# EAGLE design roland_121_vcf_with_12db (EAGLE 7.2.0)
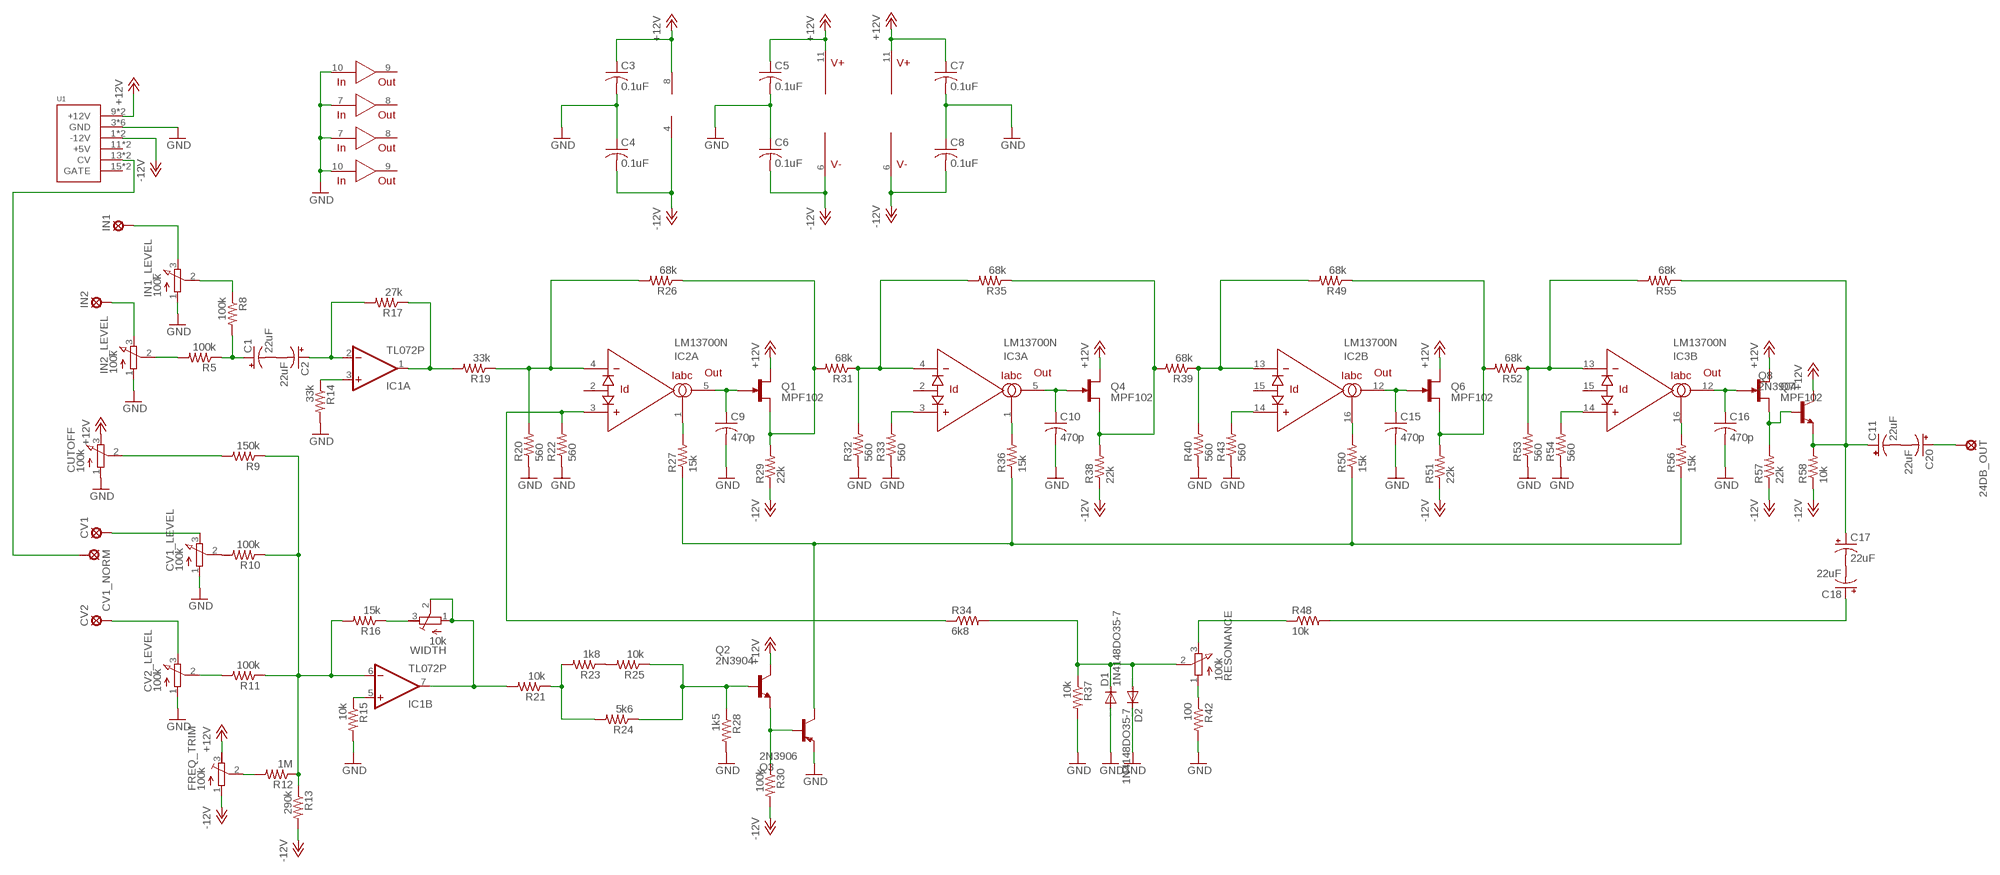
[diagram p0: schematic, sheet 1]

## Parts
24DB_OUT  LSP10  [LSP10]
C1  22uF  CPOL-USB45181A  [B45181A]
C2  22uF  CPOL-USB45181A  [B45181A]
C3  0.1uF  C-US025-030X050  [C025-030X050]
C4  0.1uF  C-US025-030X050  [C025-030X050]
C5  0.1uF  C-US025-030X050  [C025-030X050]
C6  0.1uF  C-US025-030X050  [C025-030X050]
C7  0.1uF  C-US025-030X050  [C025-030X050]
C8  0.1uF  C-US025-030X050  [C025-030X050]
C9  470p  C-US025-030X050  [C025-030X050]
C10  470p  C-US025-030X050  [C025-030X050]
C11  22uF  CPOL-USB45181A  [B45181A]
C15  470p  C-US025-030X050  [C025-030X050]
C16  470p  C-US025-030X050  [C025-030X050]
C17  22uF  CPOL-USB45181A  [B45181A]
C18  22uF  CPOL-USB45181A  [B45181A]
C20  22uF  CPOL-USB45181A  [B45181A]
CUTOFF  100k  3RP/1610N  [3RP/1610N]
CV1  LSP10  [LSP10]
CV1_LEVEL  100k  3RP/1610N  [3RP/1610N]
CV1_NORM  LSP10  [LSP10]
CV2  LSP10  [LSP10]
CV2_LEVEL  100k  3RP/1610N  [3RP/1610N]
D1  1N4148DO35-7  [DO35-7]
D2  1N4148DO35-7  [DO35-7]
FREQ_TRIM  100k  R-TRIMM64W  [RTRIM64W]
IC1  TL072P  [DIL08]
IC2  LM13700N  [DIL16]
IC3  LM13700N  [DIL16]
IN1  LSP10  [LSP10]
IN1_LEVEL  100k  3RP/1610N  [3RP/1610N]
IN2  LSP10  [LSP10]
IN2_LEVEL  100k  3RP/1610N  [3RP/1610N]
Q1  MPF102  [TO92F]
Q2  2N3904  [TO92]
Q3  2N3906  [TO92]
Q4  MPF102  [TO92F]
Q6  MPF102  [TO92F]
Q7  MPF102  [TO92F]
Q8  2N3904  [TO92]
R5  100k  R-US_0207/7  [0207/7]
R8  100k  R-US_0207/7  [0207/7]
R9  150k  R-US_0207/7  [0207/7]
R10  100k  R-US_0207/7  [0207/7]
R11  100k  R-US_0207/7  [0207/7]
R12  1M  R-US_0207/7  [0207/7]
R13  290k  R-US_0207/7  [0207/7]
R14  33k  R-US_0207/7  [0207/7]
R15  10k  R-US_0207/7  [0207/7]
R16  15k  R-US_0207/7  [0207/7]
R17  27k  R-US_0207/7  [0207/7]
R19  33k  R-US_0207/7  [0207/7]
R20  560  R-US_0207/7  [0207/7]
R21  10k  R-US_0207/7  [0207/7]
R22  560  R-US_0207/7  [0207/7]
R23  1k8  R-US_0207/7  [0207/7]
R24  5k6  R-US_0207/7  [0207/7]
R25  10k  R-US_0207/7  [0207/7]
R26  68k  R-US_0207/7  [0207/7]
R27  15k  R-US_0207/7  [0207/7]
R28  1k5  R-US_0207/7  [0207/7]
R29  22k  R-US_0207/7  [0207/7]
R30  100k  R-US_0207/7  [0207/7]
R31  68k  R-US_0207/7  [0207/7]
R32  560  R-US_0207/7  [0207/7]
R33  560  R-US_0207/7  [0207/7]
R34  6k8  R-US_0207/7  [0207/7]
R35  68k  R-US_0207/7  [0207/7]
R36  15k  R-US_0207/7  [0207/7]
R37  10k  R-US_0207/7  [0207/7]
R38  22k  R-US_0207/7  [0207/7]
R39  68k  R-US_0207/7  [0207/7]
R40  560  R-US_0207/7  [0207/7]
R42  100  R-US_0207/7  [0207/7]
R43  560  R-US_0207/7  [0207/7]
R48  10k  R-US_0207/7  [0207/7]
R49  68k  R-US_0207/7  [0207/7]
R50  15k  R-US_0207/7  [0207/7]
R51  22k  R-US_0207/7  [0207/7]
R52  68k  R-US_0207/7  [0207/7]
R53  560  R-US_0207/7  [0207/7]
R54  560  R-US_0207/7  [0207/7]
R55  68k  R-US_0207/7  [0207/7]
R56  15k  R-US_0207/7  [0207/7]
R57  22k  R-US_0207/7  [0207/7]
R58  10k  R-US_0207/7  [0207/7]
RESONANCE  100k  3RP/1610N  [3RP/1610N]
U1  POWER  [POWER_16]
WIDTH  10k  R-TRIMM64W  [RTRIM64W]

## Nets
+12V: C3.1 C5.1 C7.1 CUTOFF.3(E) FREQ_TRIM.3(E) IC1.8(P:V+) IC2.11(V+) IC3.11(V+) Q1.1(D) Q2.1(C) Q4.1(D) Q6.1(D) Q7.1(D) Q8.1(C) U1.9(+12V) U1.10(+12V)
-12V: C4.2 C6.2 C8.2 FREQ_TRIM.1(A) IC1.4(P:V-) IC2.6(V-) IC3.6(V-) R13.2 R29.1 R30.2 R38.1 R51.1 R57.1 R58.1 U1.1(-12V) U1.2(-12V)
GND: C3.2 C4.1 C5.2 C6.1 C7.2 C8.1 C9.2 C10.2 C15.2 C16.2 CUTOFF.1(A) CV1_LEVEL.1(A) CV2_LEVEL.1(A) D1.A D2.C IC2.7(IN) IC2.10(IN) IC3.7(IN) IC3.10(IN) IN1_LEVEL.1(A) IN2_LEVEL.1(A) Q3.3(E) R14.2 R15.2 R20.1 R22.1 R28.2 R32.1 R33.1 R37.2 R40.1 R42.2 R43.1 R53.1 R54.1 U1.3(GND) U1.4(GND) U1.5(GND) U1.6(GND) U1.7(GND) U1.8(GND)
N$1: IC2.1(A:IABC) R27.2
N$2: IC3.1(A:IABC) R36.2
N$3: IC3.4(A:-IN) R31.1 R32.2 R35.2
N$4: IC3.3(A:+IN) R33.2
N$5: IN2_LEVEL.2(S) R5.2
N$6: C1.+ R5.1 R8.2
N$7: C2.+ IC1.2(A:-IN) R17.2
N$8: IC1.1(A:OUT) R17.1 R19.2
N$9: R16.1 WIDTH.3(E)
N$10: CV2_LEVEL.2(S) R11.2
N$11: IC1.3(A:+IN) R14.1
N$12: IC1.5(B:+IN) R15.1
N$13: IC1.7(B:OUT) R21.2 WIDTH.1(A) WIDTH.2(S)
N$14: IC2.16(B:IABC) R50.2
N$15: IC2.13(B:-IN) R39.1 R40.2 R49.2
N$16: IC1.6(B:-IN) R9.1 R10.1 R11.1 R12.1 R13.1 R16.2
N$17: FREQ_TRIM.2(S) R12.2
N$18: R23.1 R25.2
N$19: R21.1 R23.2 R24.2
N$20: Q2.2(B) R24.1 R25.1 R28.1
N$21: Q2.3(E) Q3.2(B) R30.1
N$22: IC2.4(A:-IN) R19.1 R20.2 R26.2
N$23: IC2.3(A:+IN) R22.2 R34.1
N$24: IC2.14(B:+IN) R43.2
N$25: IC3.16(B:IABC) R56.2
N$26: IC3.13(B:-IN) R52.1 R53.2 R55.2
N$27: IC3.14(B:+IN) R54.2
N$28: Q1.2(S) R26.1 R29.2 R31.2
N$29: 24DB_OUT.MP C20.+
N$30: C11.- C20.-
N$34: IN2.MP IN2_LEVEL.3(E)
N$39: C1.- C2.-
N$40: C9.1 IC2.5(A:OUT) Q1.3(G)
N$41: C10.1 IC3.5(A:OUT) Q4.3(G)
N$42: C15.1 IC2.12(B:OUT) Q6.3(G)
N$43: C16.1 IC3.12(B:OUT) Q7.3(G)
N$44: Q6.2(S) R49.1 R51.2 R52.2
N$45: Q3.1(C) R27.1 R36.1 R50.1 R56.1
N$46: Q4.2(S) R35.1 R38.2 R39.2
N$47: Q7.2(S) Q8.2(B) R57.2
N$48: R42.1 RESONANCE.1(A)
N$49: C17.- C18.-
N$50: C18.+ R48.2
N$51: R48.1 RESONANCE.3(E)
N$52: D1.C D2.A R34.2 R37.1 RESONANCE.2(S)
N$53: CV1_LEVEL.2(S) R10.2
N$54: CV2.MP CV2_LEVEL.3(E)
N$55: CV1_NORM.MP U1.13(CV) U1.14(CV)
N$56: CUTOFF.2(S) R9.2
N$57: IN1_LEVEL.2(S) R8.1
N$58: IN1.MP IN1_LEVEL.3(E)
N$59: CV1.MP CV1_LEVEL.3(E)
N$60: C11.+ C17.+ Q8.3(E) R55.1 R58.2
Unconnected: IC2.2(A:ID) IC2.8(OUT) IC2.9(OUT) IC2.15(B:ID) IC3.2(A:ID) IC3.8(OUT) IC3.9(OUT) IC3.15(B:ID) U1.11(+5V) U1.12(+5V) U1.15(GATE) U1.16(GATE)

## Library data of the parts
24DB_OUT CV1 CV1_NORM CV2 IN1 IN2 = solpad:LSP10: SOLDER PAD drill 1.0 mm, distributor Buerklin, 12H555
C1 C2 C11 C17 C18 C20 = rcl:CPOL-US: POLARIZED CAPACITOR, American symbol
C3-C10 C15 C16 = rcl:C-US: CAPACITOR, American symbol
CUTOFF CV1_LEVEL CV2_LEVEL IN1_LEVEL IN2_LEVEL RESONANCE = pot:3RP/1610N: 16mm Potentiometer one level Source: http://www.alphapotentiometers.net/html/16mm_pot_2.html
D1 D2 = diode:1N4148: DIODE high speed (Philips)
FREQ_TRIM WIDTH = rcl:R-TRIMM: Trimm resistor
IC1 = linear:TL072: OP AMP
IC2 IC3 = synthdiy updated imperial:LM13700: National Dual OTA with buffers.
Q1 Q4 Q6 Q7 = mes_transistors:MPF102: JFET VHF Amplifier Small signal transistor. N-channel depletion FET
Q2 Q8 = transistor-npn:2N3904: NPN Transistor
Q3 = transistor-pnp:2N3906: PNP Transistor
R5 R8-R17 R19-R40 R42 R43 R48-R58 = rcl:R-US_: RESISTOR, American symbol
U1 = eurorack:POWER

## Board
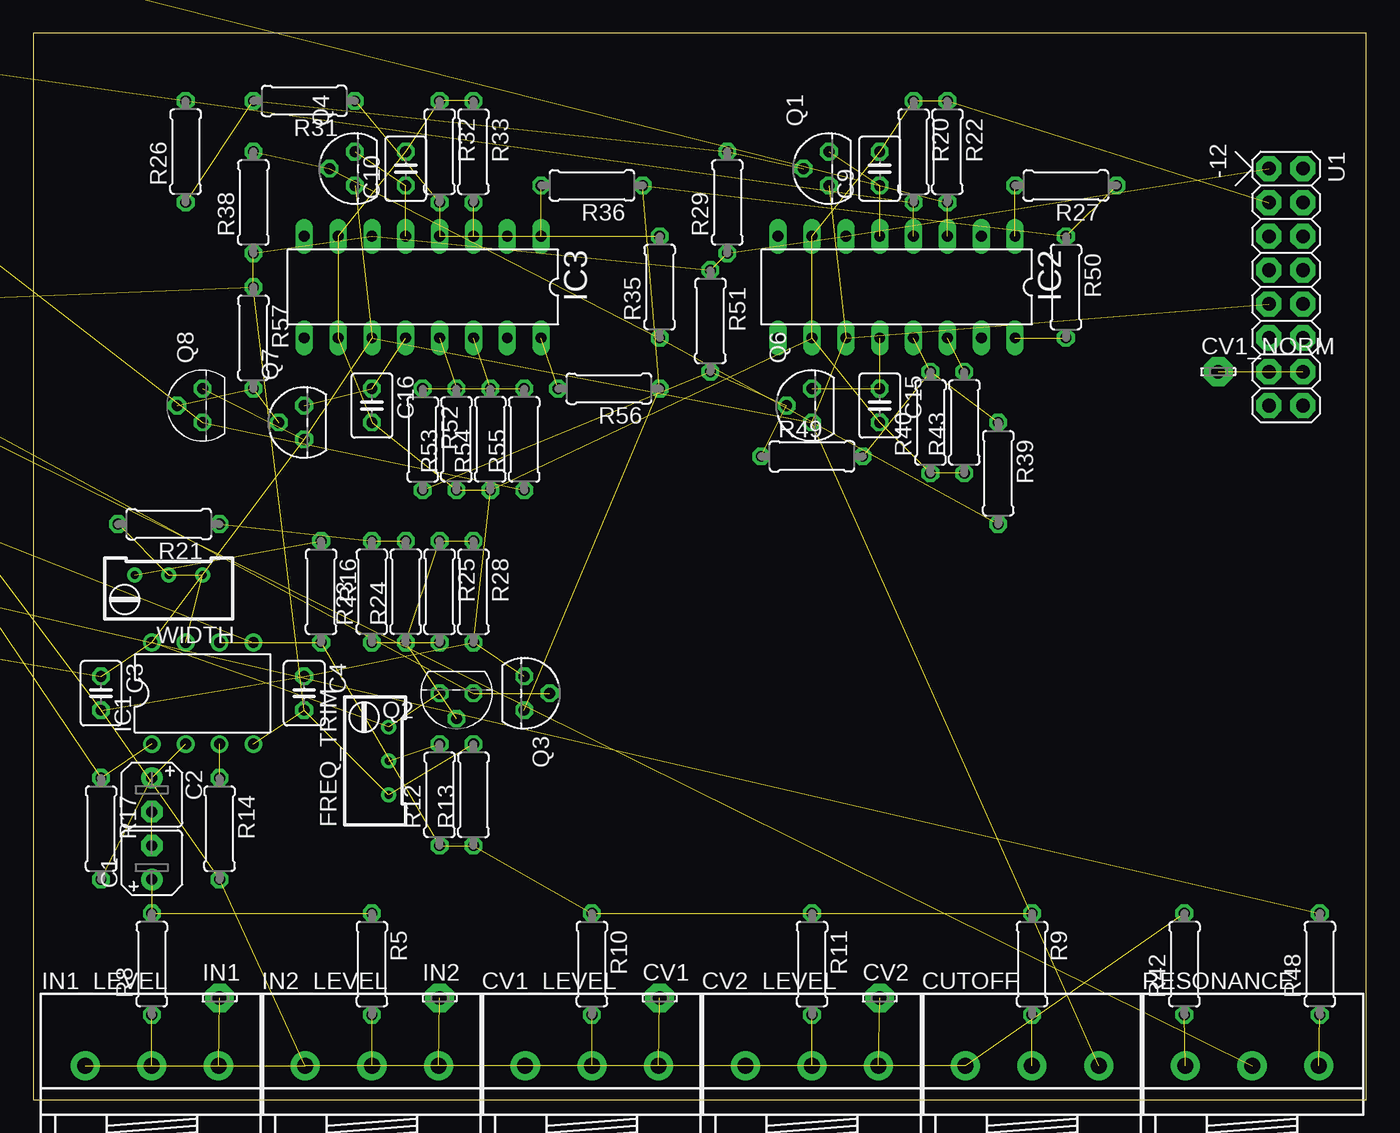
[diagram p1: board, top side]
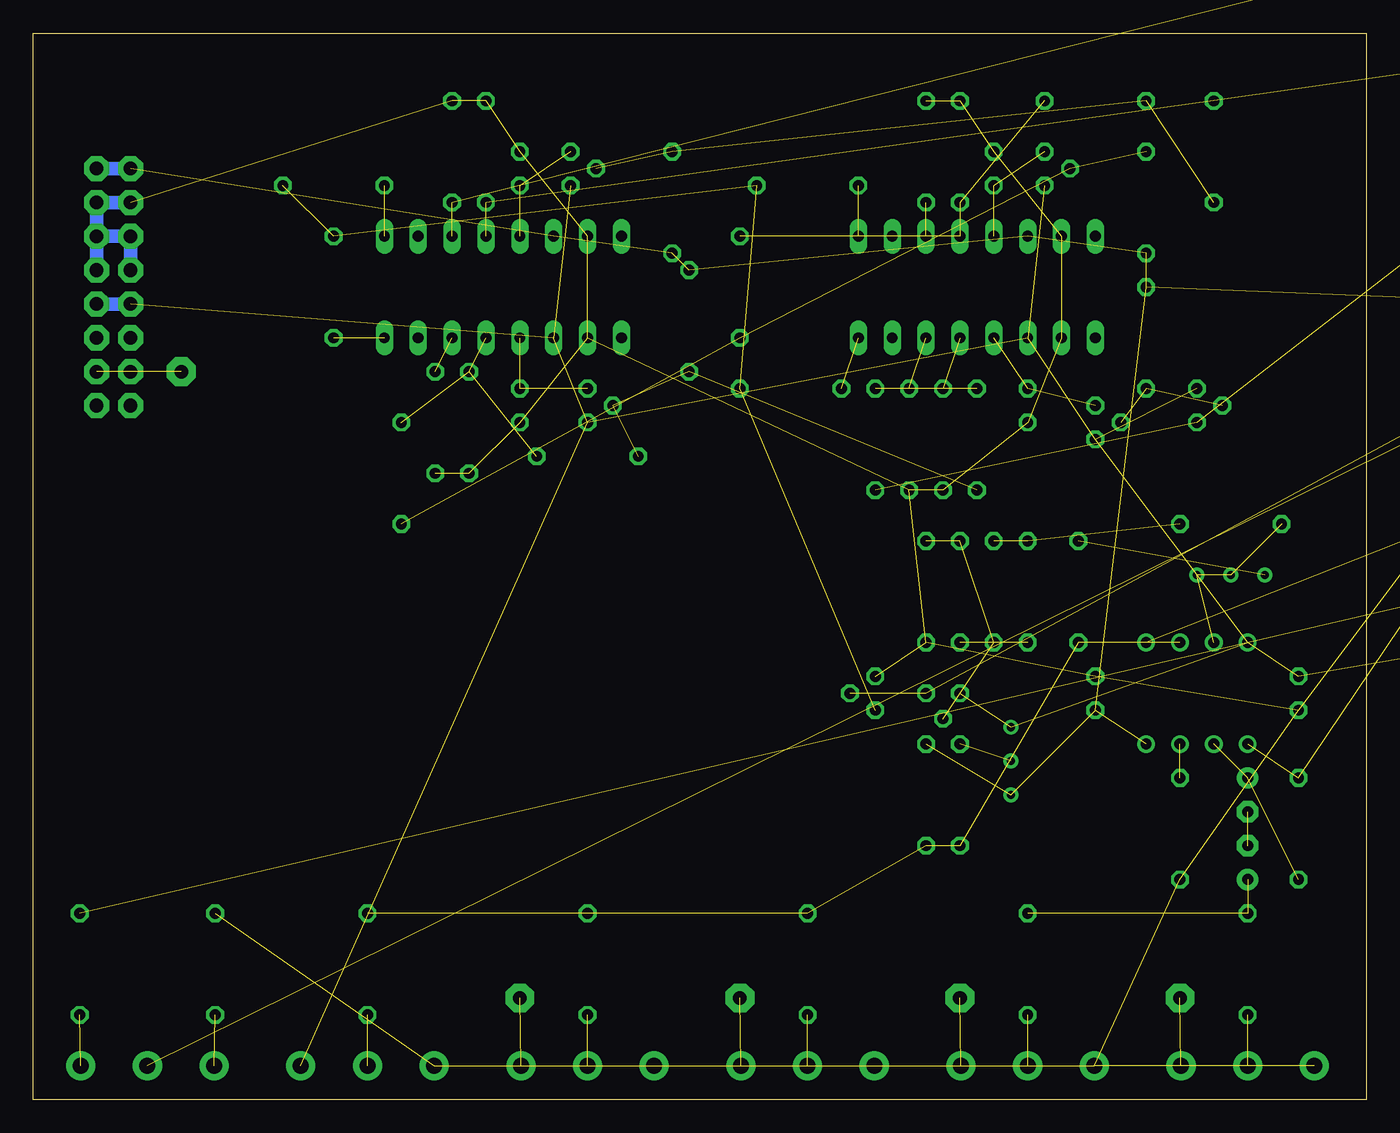
[diagram p2: board, bottom side, seen from below]

Size 100 x 80 mm. Coordinates in mm from the lower left corner, seen from the top.
Outline: 0,0 100,0 100,80 0,80 0,0
Copper layers (1*16): Top 0.035mm / dielectric 1.5mm / Bottom 0.035mm
Design rules "default": minimum track width 10mil, minimum drill 24mil, track to track 8mil, track to pad 8mil, pad to pad 8mil, via to via 8mil, smd to smd 8mil, copper to edge 40mil, drill to drill 8mil, minimum pad ring 10mil, minimum via ring 8mil, stop-mask expansion 4mil, vias tented up to drill 0mil, thermal gap 10mil

### Footprints (pad centres in the part's own frame; a part is rotated, then mirrored left to right if it is on the bottom)
LSP10 = drill 1.016 pad 2.159 octagon: MP 0,0
B45181A = drill 0.813 pad 1.6: + -1.27,0 | drill 0.813 pad 1.6 octagon: - 1.27,0
C025-030X050 = drill 0.813 octagon: 1 -1.27,0; 2 1.27,0
3RP/1610N = drill 1.2 pad 2.184: 1 -5,0; 2 0,0; 3 5,0
DO35-7 = drill 0.813 long: A 3.81,0; C -3.81,0
RTRIM64W = drill 0.61: 1 1.27,-2.54; 2 1.27,0; 3 1.27,2.54
DIL08 = drill 0.813 pad 1.27: 1 -3.81,-3.81; 2 -1.27,-3.81; 3 1.27,-3.81; 4 3.81,-3.81; 5 3.81,3.81; 6 1.27,3.81; 7 -1.27,3.81; 8 -3.81,3.81
DIL16 = drill 0.813 long: 1 -8.89,-3.81; 2 -6.35,-3.81; 3 -3.81,-3.81; 4 -1.27,-3.81; 5 1.27,-3.81; 6 3.81,-3.81; 7 6.35,-3.81; 8 8.89,-3.81; 9 8.89,3.81; 10 6.35,3.81; 11 3.81,3.81; 12 1.27,3.81; 13 -1.27,3.81; 14 -3.81,3.81; 15 -6.35,3.81; 16 -8.89,3.81
TO92F = drill 0.813 octagon: 1 -1.27,0; 2 0,1.905; 3 1.27,0
TO92 = drill 0.813 octagon: 1 1.27,0; 2 0,1.905; 3 -1.27,0
0207/7 = drill 0.813 octagon: 1 -3.81,0; 2 3.81,0
POWER_16 = drill 1.016 pad 1.88 octagon: 1 -6.35,-1.27; 2 -6.35,1.27; 3 -3.81,-1.27; 4 -3.81,1.27; 5 -1.27,-1.27; 6 -1.27,1.27; 7 1.27,-1.27; 8 1.27,1.27; 9 3.81,-1.27; 10 3.81,1.27; 11 6.35,-1.27; 12 6.35,1.27; 13 8.89,-1.27; 14 8.89,1.27; 15 11.43,-1.27; 16 11.43,1.27

### Placement (x,y rotation side)
24DB_OUT  -85.09,102.87 0 top  (outside the outline)
C1  8.89,17.78 90 top
C2  8.89,22.86 270 top
C3  5.08,30.48 270 top
C4  20.32,30.48 270 top
C5  -82.55,46.99 0 top  (outside the outline)
C6  -88.9,46.99 0 top  (outside the outline)
C7  -95.25,46.99 0 top  (outside the outline)
C8  -16.51,59.69 0 top  (outside the outline)
C9  63.5,69.85 90 top
C10  27.94,69.85 90 top
C11  -73.66,58.42 0 top  (outside the outline)
C15  63.5,52.07 270 top
C16  25.4,52.07 270 top
C17  -83.82,58.42 0 top  (outside the outline)
C18  -93.98,58.42 0 top  (outside the outline)
C20  -21.59,66.04 0 top  (outside the outline)
CUTOFF  74.93,2.54 0 top
CV1  46.99,7.62 0 top
CV1_LEVEL  41.91,2.54 0 top
CV1_NORM  88.9,54.61 0 top
CV2  63.5,7.62 0 top
CV2_LEVEL  58.42,2.54 0 top
D1  -35.56,67.31 0 top  (outside the outline)
D2  -53.34,67.31 0 top  (outside the outline)
FREQ_TRIM  25.4,25.4 0 top
IC1  12.7,30.48 0 top
IC2  64.77,60.96 180 top
IC3  29.21,60.96 180 top
IN1  13.97,7.62 0 top
IN1_LEVEL  8.89,2.54 0 top
IN2  30.48,7.62 0 top
IN2_LEVEL  25.4,2.54 0 top
Q1  59.69,69.85 90 top
Q2  31.75,30.48 180 top
Q3  36.83,30.48 270 top
Q4  24.13,69.85 90 top
Q6  58.42,52.07 90 top
Q7  20.32,50.8 90 top
Q8  12.7,52.07 90 top
R5  25.4,10.16 270 top
R8  8.89,10.16 90 top
R9  74.93,10.16 270 top
R10  41.91,10.16 270 top
R11  58.42,10.16 270 top
R12  30.48,22.86 90 top
R13  33.02,22.86 90 top
R14  13.97,20.32 270 top
R15  -88.9,77.47 0 top  (outside the outline)
R16  21.59,38.1 270 top
R17  5.08,20.32 270 top
R19  -38.1,82.55 0 top  (outside the outline)
R20  66.04,71.12 270 top
R21  10.16,43.18 180 top
R22  68.58,71.12 270 top
R23  25.4,38.1 90 top
R24  27.94,38.1 90 top
R25  30.48,38.1 270 top
R26  11.43,71.12 90 top
R27  77.47,68.58 180 top
R28  33.02,38.1 270 top
R29  52.07,67.31 90 top
R30  -68.58,87.63 0 top  (outside the outline)
R31  20.32,74.93 180 top
R32  30.48,71.12 270 top
R33  33.02,71.12 270 top
R34  -27.94,92.71 0 top  (outside the outline)
R35  46.99,60.96 90 top
R36  41.91,68.58 180 top
R37  -58.42,92.71 0 top  (outside the outline)
R38  16.51,67.31 90 top
R39  72.39,46.99 270 top
R40  67.31,50.8 90 top
R42  86.36,10.16 90 top
R43  69.85,50.8 90 top
R48  96.52,10.16 90 top
R49  58.42,48.26 0 top
R50  77.47,60.96 270 top
R51  50.8,58.42 270 top
R52  29.21,49.53 270 top
R53  31.75,49.53 90 top
R54  34.29,49.53 90 top
R55  36.83,49.53 90 top
R56  43.18,53.34 180 top
R57  16.51,57.15 270 top
R58  -58.42,102.87 0 top  (outside the outline)
RESONANCE  91.44,2.54 0 top
U1  93.98,63.5 270 top
WIDTH  10.16,38.1 90 top

### Tracks (layer width: path | path; a pad name or v marks a point on that pad's centre or on a via)
+12V  (14 unrouted)
  Bottom 1.016: U1.9 U1.10
-12V  (14 unrouted)
  Bottom 1.016: U1.1 U1.2
GND  (35 unrouted)
  Bottom 1.016: U1.7 U1.5 U1.6 | U1.3 U1.4 U1.6 | U1.8 U1.6
N$1  (1 unrouted)
N$2  (1 unrouted)
N$3  (3 unrouted)
N$4  (1 unrouted)
N$5  (1 unrouted)
N$6  (2 unrouted)
N$7  (2 unrouted)
N$8  (2 unrouted)
N$9  (1 unrouted)
N$10  (1 unrouted)
N$11  (1 unrouted)
N$12  (1 unrouted)
N$13  (3 unrouted)
N$14  (1 unrouted)
N$15  (3 unrouted)
N$16  (6 unrouted)
N$17  (1 unrouted)
N$18  (1 unrouted)
N$19  (2 unrouted)
N$20  (3 unrouted)
N$21  (2 unrouted)
N$22  (3 unrouted)
N$23  (2 unrouted)
N$24  (1 unrouted)
N$25  (1 unrouted)
N$26  (3 unrouted)
N$27  (1 unrouted)
N$28  (3 unrouted)
N$29  (1 unrouted)
N$30  (1 unrouted)
N$34  (1 unrouted)
N$39  (1 unrouted)
N$40  (2 unrouted)
N$41  (2 unrouted)
N$42  (2 unrouted)
N$43  (2 unrouted)
N$44  (3 unrouted)
N$45  (4 unrouted)
N$46  (3 unrouted)
N$47  (2 unrouted)
N$48  (1 unrouted)
N$49  (1 unrouted)
N$50  (1 unrouted)
N$51  (1 unrouted)
N$52  (4 unrouted)
N$53  (1 unrouted)
N$54  (1 unrouted)
N$55  (2 unrouted)
N$56  (1 unrouted)
N$57  (1 unrouted)
N$58  (1 unrouted)
N$59  (1 unrouted)
N$60  (4 unrouted)